# Altium schematic sheet dv_power_chanel.SchDoc: =GlobalProjectName
size 209 x 297 mm; ApprovedBy: Утвердил; CheckedBy: Проверил; Author: Разработал; SheetNumber: 2; SheetTotal: 2; PageSetup: Record=PageOptions|CenterHorizontal=True|CenterVertical=True|PrintScale=1.00|XCorrection=1.00|YCorrection=1.00|PrintKind=1|BorderSize=5000000|LeftOffset=0|BottomOffset=0|Orientation=2|PaperLength=1000|PaperWidth=1000|Scale=100|PaperSource=15|PrintQuality=1200|MediaType=1|DitherType=10|PaperKind=A3|PrintScaleMode=1; Weight: -; ScaleFactor: -; NormInspection: Норм.Контр.
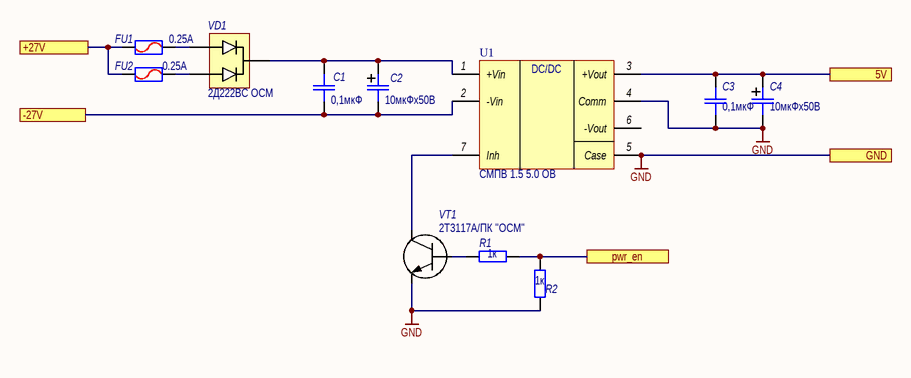
[diagram p0: dv_power_chanel.SchDoc]

## Parts
C1  value 0,1мкФ  [SMD_C0805]  (hidden comment: K10-79)
C2  value 10мкФх50В  [SMD_size_B]  (hidden comment: OS K53-68)
C3  value 0,1мкФ  [SMD_C0805]  (hidden comment: K10-79)
C4  value 10мкФх50В  [SMD_size_B]  (hidden comment: OS K53-68)
FU1  value 0.25A  [VP1-2]  (hidden comment: VP1-2)
FU2  value 0.25A  [VP1-2]  (hidden comment: VP1-2)
R1  value 1к  [SMD_0805]  (hidden comment: OSM R1-12)
R2  value 1к  [SMD_0805]  (hidden comment: OSM R1-12)
U1  Наименование: СМПВ 1.5 5.0 ОВ  [SLH28xx]  (hidden comment: SMPV 1.5 5.0 OV)
VD1  Наименование: 2Д222ВС ОСМ  [4116.4-3_offcut]  (hidden comment: 2D222VS "OSM")
VT1  Наименование: 2Т3117А/ПК "ОСМ"  [TO-18]  (hidden comment: 2T3117A)

## Ports
5V, +27V, -27V, GND, pwr_en

## Nets
GND: C3.1 C4.2 R2.1 U1.4(Comm) U1.5(Case) VT1.1(EMITTER) ; port GND
5V: C3.2 C4.1 U1.3(+Vout) ; port 5V
+27V: FU1.1 FU2.1 ; port +27V
-27V: C1.1 C2.2 U1.2(-Vin) ; port -27V
pwr_en: R1.2 R2.2 ; port pwr_en
NetC1_2: C1.2 C2.1 U1.1(+Vin) VD1.8
NetFU1_2: FU1.2 VD1.11
NetFU2_2: FU2.2 VD1.17
NetR1_1: R1.1 VT1.2(BASE)
NetU1_7: U1.7(Inh) VT1.3(COLLECTOR)

Not connected (* = marked no-connect by the designer): U1 6(-Vout)

## Notes on the sheet
- Подп. и дата
- Инв. № дубл.
- Взам. инв. №
- Инв. № подл.
- Изм.
- Лист
- № докум.
- Подп.
- Дата
- Форма 2а ГОСТ 2.104-2006
- Копировал
- Формат А4
- (in symbol SLH28xx) DC/DC

## Library data of the parts
C1 C3 = Capacitor: Назначение: SMD-конденсатор; Наименование: К10-79; Потребление, Вт: 0; Напряжение: В; Точность: %
C2 C4 = Capacitor_pol: Polarized capacitor; Назначение: Поляризованный SMD-конденсатор; Наименование: ОС К53-68; Потребление, Вт: 0
FU1 FU2 = VP1-2: Предохранитель плавкий; Наименование: ВП1-2 "ВП"; Назначение: Предохранитель плавкий; ComponentLink1Description: DataSheet; ComponentLink1URL: https://docviewer.yandex.ru/view/20572601/?page=1&*=oYyHA%2BCwzeyRvrmOJV6%2ByaBlbHJ7InVybCI6Imh0dHBzOi8vZWwtcmEucnUvdXBsb2FkL2libG9jay8wMTYvdnN0YXZrYS1wbGF2a2EtdnAxXzItX2VsZWt0cm9uaWthX3JhXy5wZGYiLCJ0aXRsZSI6InZzdGF2a2EtcGxhdmthLXZwMV8yLV9lbGVrdHJvbmlrYV9yYV8ucGRmIiwibm9pZnJhbWUiOnRydWUsInVpZCI6IjIwNTcyNjAxIiwidHMiOjE1OTI0NzI0NTM1MTUsInl1IjoiODg5MDYxMzMxNTQzMzg3MTIxIiwic2VycFBhcmFtcyI6Imxhbmc9cnUmdG09MTU5MjQ3MjQyOCZ0bGQ9cnUmbmFtZT12c3RhdmthLXBsYXZrYS12cDFfMi1fZWxla3Ryb25pa2FfcmFfLnBkZiZ0ZXh0PSVEMCVCMiVEMCVCRjEtMiZ1cmw9aHR0cHMlM0EvL2VsLXJhLnJ1L3VwbG9hZC9pYmxvY2svMDE2L3ZzdGF2a2EtcGxhdmthLXZwMV8yLV9lbGVrdHJvbmlrYV9yYV8ucGRmJmxyPTY1Jm1pbWU9cGRmJmwxMG49cnUmc2lnbj0yZWMwNDRiZDQyMGRlMjRmMjI1MThkNTc4YjZlMTlkYiZrZXlubz0wIn0%3D&lang=ru
R1 R2 = Resistor: Наименование: ОСМ Р1-12; Назначение: SMD-резистор; Потребление, Вт: 0,001; Точность: %
U1 = SLH28xx: DC-DC; Назначение: DC-DC преобразователь; Потребление, Вт: 0.1; ComponentLink1Description: DataSheet; ComponentLink1URL: https://www.interpoint.com/product_documents/SLH_Space_DC_DC_Converters.pdf
VD1 = 2D222: Сдвоенный диод; Потребление, Вт: 0,004; Назначение: Сдвоенный диод; ComponentLink1Description: DataSheet; ComponentLink1URL: https://eandc.ru/pdf/diod/2d222.pdf
VT1 = 2T3117A: Кремниевый биполярный / эпитаксиально-планарный / n-p-n транзистор; Назначение: Биполярный транзистор; Потребление, Вт: 0,0; ComponentLink1Description: DataSheet; ComponentLink1URL: https://www.integral.by/sites/default/files/pdf/2t3117.pdf